# EAGLE schematic npsu (EAGLE 9.6.1)
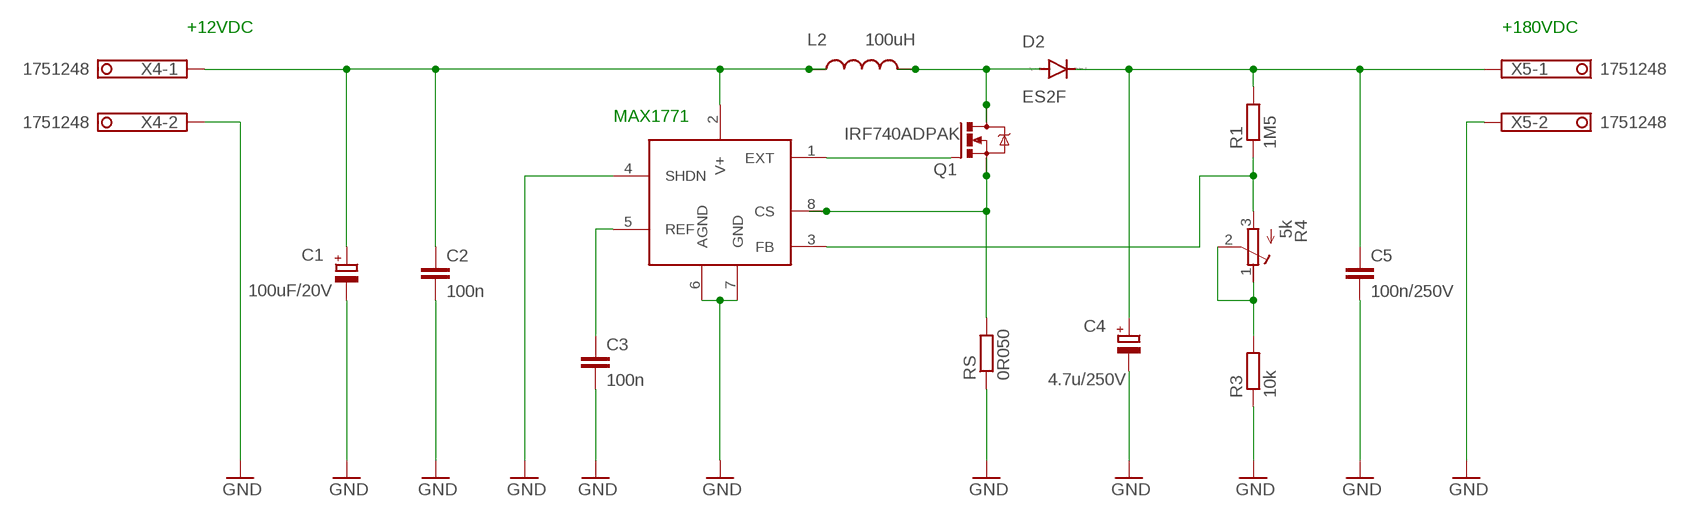
[diagram p0: schematic, sheet 1]

## Parts
C1  100uF/20V  CPOL-EUSMCD  [SMC_D]
C2  100n  C-EUC0805  [C0805]
C3  100n  C-EUC0805  [C0805]
C4  4.7u/250V  CPOL-EU140CLH-0810  [140CLH-0810]
C5  100n/250V  C-EUC1210  [C1210]
D2  ES2F  ES2D  [SMB]
L2  100uH  INDUCTORDR1030  [DR1030]
MAX1771  MAX1771  [SO08]
Q1  IRF740ADPAK  [TO-263/D2PAK]
R1  1M5  R-EU_R0805  [R0805]
R3  10k  R-EU_R0805  [R0805]
R4  5k  R-TRIMM3314G  [RTRIM3314G]
RS  0R050  R-EU_R1206  [R1206]
X4  1751248  [1751248]
X5  1751248  [1751248]

## Nets
+12V: C1.+ C2.1 L2.1 MAX1771.2(V+) X4.1
GND: C1.- C2.2 C3.2 C4.- C5.2 MAX1771.4(SHDN) MAX1771.6(AGND) MAX1771.7(GND) R3.1 RS.1 X4.2 X5.2
N$1: MAX1771.8(CS) Q1.3(S) RS.2
N$17: MAX1771.3(FB) R1.1 R4.3(A)
N$18: C4.+ C5.1 D2.C R1.2 X5.1
N$19: D2.A L2.2 Q1.2(D)
N$20: C3.1 MAX1771.5(REF)
N$21: MAX1771.1(EXT) Q1.1(G)
N$32: R3.2 R4.1(E) R4.2(S)

## Notes on the sheet
- +12VDC | +180VDC
- MAX1771

## Library data of the parts
C1 = rcl:CPOL-EU: POLARIZED CAPACITOR, European symbol; SPICEPREFIX: C
C2 C3 C5 = rcl:C-EU: CAPACITOR, European symbol
C4 = rcl:CPOL-EU: POLARIZED CAPACITOR, European symbol
D2 = diode:ES2D: DIODE super fast rectifier, 2 A
L2 = mixos:INDUCTOR: Inductors Basic Inductor/Choke - 0603 and 1206. Footprints are not proven and vary greatly between part numbers.
MAX1771 = nixie_clock:MAX1771
Q1 = mixos:IRF740A: N-CHANNEL MOS FET
R1 R3 RS = rcl:R-EU_: RESISTOR, European symbol
R4 = resistor:R-TRIMM: Trimm resistor
X4 X5 = con-phoenix-350:1751248: MKDS 1/ 2-3,5 Printklemme Nennstrom: 10 A Bemessungsspannung: 160 V Raster: 3,5 mm Polzahl: 2 Montageart: Löten Anschlussart: Schraubanschluss Anschlussrichtung vom Leiter zur Platine: 0° Source: http://eshop.phoenixcontact.com .. 1751248.pdf; OC_FARNELL: unknown; OC_NEWARK: unknown

## Net classes
1 power: width 0.762 mm, clearance 0.508 mm